# Altium schematic sheet BPC.MSys.Struct.SchDoc
size 420 x 297 mm; Address1: Address1; Address2: Address2; Address3: Address3; Address4: Address4; SheetNumber: 1; Scale: 1:1; Разраб.: Иванов; Обозначение документа: АБВГ.123456.001 Э3; Пров.: Петров; Утв.: Сидоров; Наименование организации: ОАО "Концерн "МПО-Гидроприбор"; Перв. применение: АБВГ.123456.000; Наименование изделия 1: Плата; Наименование изделия 2: Схема электрическая; Наименование изделия 3: принципиальная; Нач. отд.: Нач. отд.; Фамилия нач. отд.: Сидоров
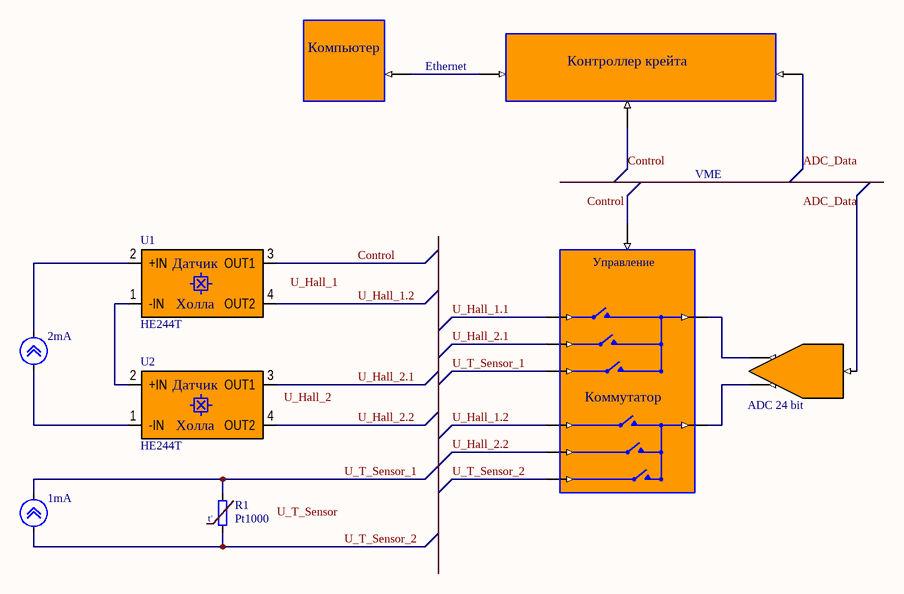
[diagram p0: BPC.MSys.Struct.SchDoc]

## Parts
(Parts that share a designator on the sheet are numbered #1, #2 ... from top to bottom, then left to right.)
G?#1  2mA  [CAPC1206]
G?#2  1mA  [CAPC1206]
R1  Pt1000  [HRTS-5760-B-U-0-12mini]
U1  HE244T  [HE244T_RightV1]
U2  HE244T  [HE244T_RightV1]
U?#1  Компьютер  (value not drawn)
U?#2  Контроллер  (value not drawn)
U?#3  Коммутатор  (value not drawn)
U?#4  ADC 24 bit  [SOIC127P600X175-8N]

## Nets
ADC_Data: U?#2.3(S3B)
Control: U1.3(OUT1) U?#2.2(S3B)
U_Hall_1.1: U?#3.4(S1A)
U_Hall_1.2: U1.4(OUT2) U?#3.13(S1B)
U_Hall_2.1: U2.3(OUT1) U?#3.5(S2A)
U_Hall_2.2: U2.4(OUT2) U?#3.12(S2B)
U_T_Sensor_1: G?#2.2(plus) R1.2 U?#3.6(S3A)
U_T_Sensor_2: G?#2.1(minus) R1.1 U?#3.11(S3B)
NetG?#1_1: G?#1.1(minus) U2.1(-IN)
NetG?#1_2: G?#1.2(plus) U1.2(+IN)
NetU1_1: U1.1(-IN) U2.2(+IN)
NetU?#1_1: U?#1.1(S3B) U?#2.1(S3B)
NetU?#3_8: U?#3.8(DA) U?#4.1(OUT)
NetU?#3_9: U?#3.9(DB) U?#4.2(OUT)

Not connected (* = marked no-connect by the designer): U?#4 3(IN+)

## Notes on the sheet
- (near U?#2) Ethernet
- VME
- Labels drawn without touching a wire or pin: ADC_Data, Control, U_Hall_1, U_Hall_2, U_T_Sensor
- Перв. примен.
- Справ. №
- Подп. и дата
- Инв. № дубл.
- Взам. инв. №
- Разраб.
- Изм.
- Лист
- № докум.
- Подп.
- Дата
- Лит.
- Масса
- Масштаб
- Пров.
- Т.контр.
- Листов
- Инв. № подл.
- Утв.
- Н.контр.
- Копировал
- Формат А3
- (in symbol HE244T) Датчик; Холла
- (in symbol Mux) Управление
- (in symbol Pt) t

## Library data of the parts
G?#1 G?#2 = iSrc: Источник тока; Vendor: Inchange; Pkg: TO247; SMD Solders: 0; Solder Option: RM; Device: 2SK1358; THD Solders: 3; Voltage: 900V; Price: 500; Name to order: 2SK1358
  G?#1: Value: 2mA
  G?#2: Value: 1mA
R1 = Pt: Pt1000 Temperature Sensors; Vendor: HoneyWell; Value: 1000; Pkg: HRTS-5760-B-U-0-12; SMD Solders: 0; Solder Option: RM; THD Solders: 2; Price: 16000; Device: Pt; Name to order: HRTS-5760-B-U-0-12
U1 U2 = HE244T: HE244 Series Analog Hall Sensor; Vendor: Advanced Sensor Tech.; Value: 2mA; Pkg: НЕ244T; SMD Solders: 0; Solder Option: RM; THD Solders: 4; Price: 20000; Device: HE244T
U?#1 = PC: Low Capacitance, Dual 4-Channel, ±15 V/+12 V iCMOS Multiplexer
U?#2 = VME CONTROLLER: Контроллер крейта
U?#3 = Mux: Low Capacitance, Dual 4-Channel, ±15 V/+12 V iCMOS Multiplexer
U?#4 = ADC: АЦП; Device: AD8676BRZ; Pkg: SOIC8_EP; SMD Solders: 8; Solder Option: RM; TC: 600nV/C; THD Solders: 0; Vendor: Analog Devices Inc; Voltage: +-5 to +-18V; Price: 3000; Name to order: AD8676BRZ; Current: 8